# Altium schematic sheet Sheet1.SchDoc
size A2; SheetNumber: 2; SheetTotal: 4
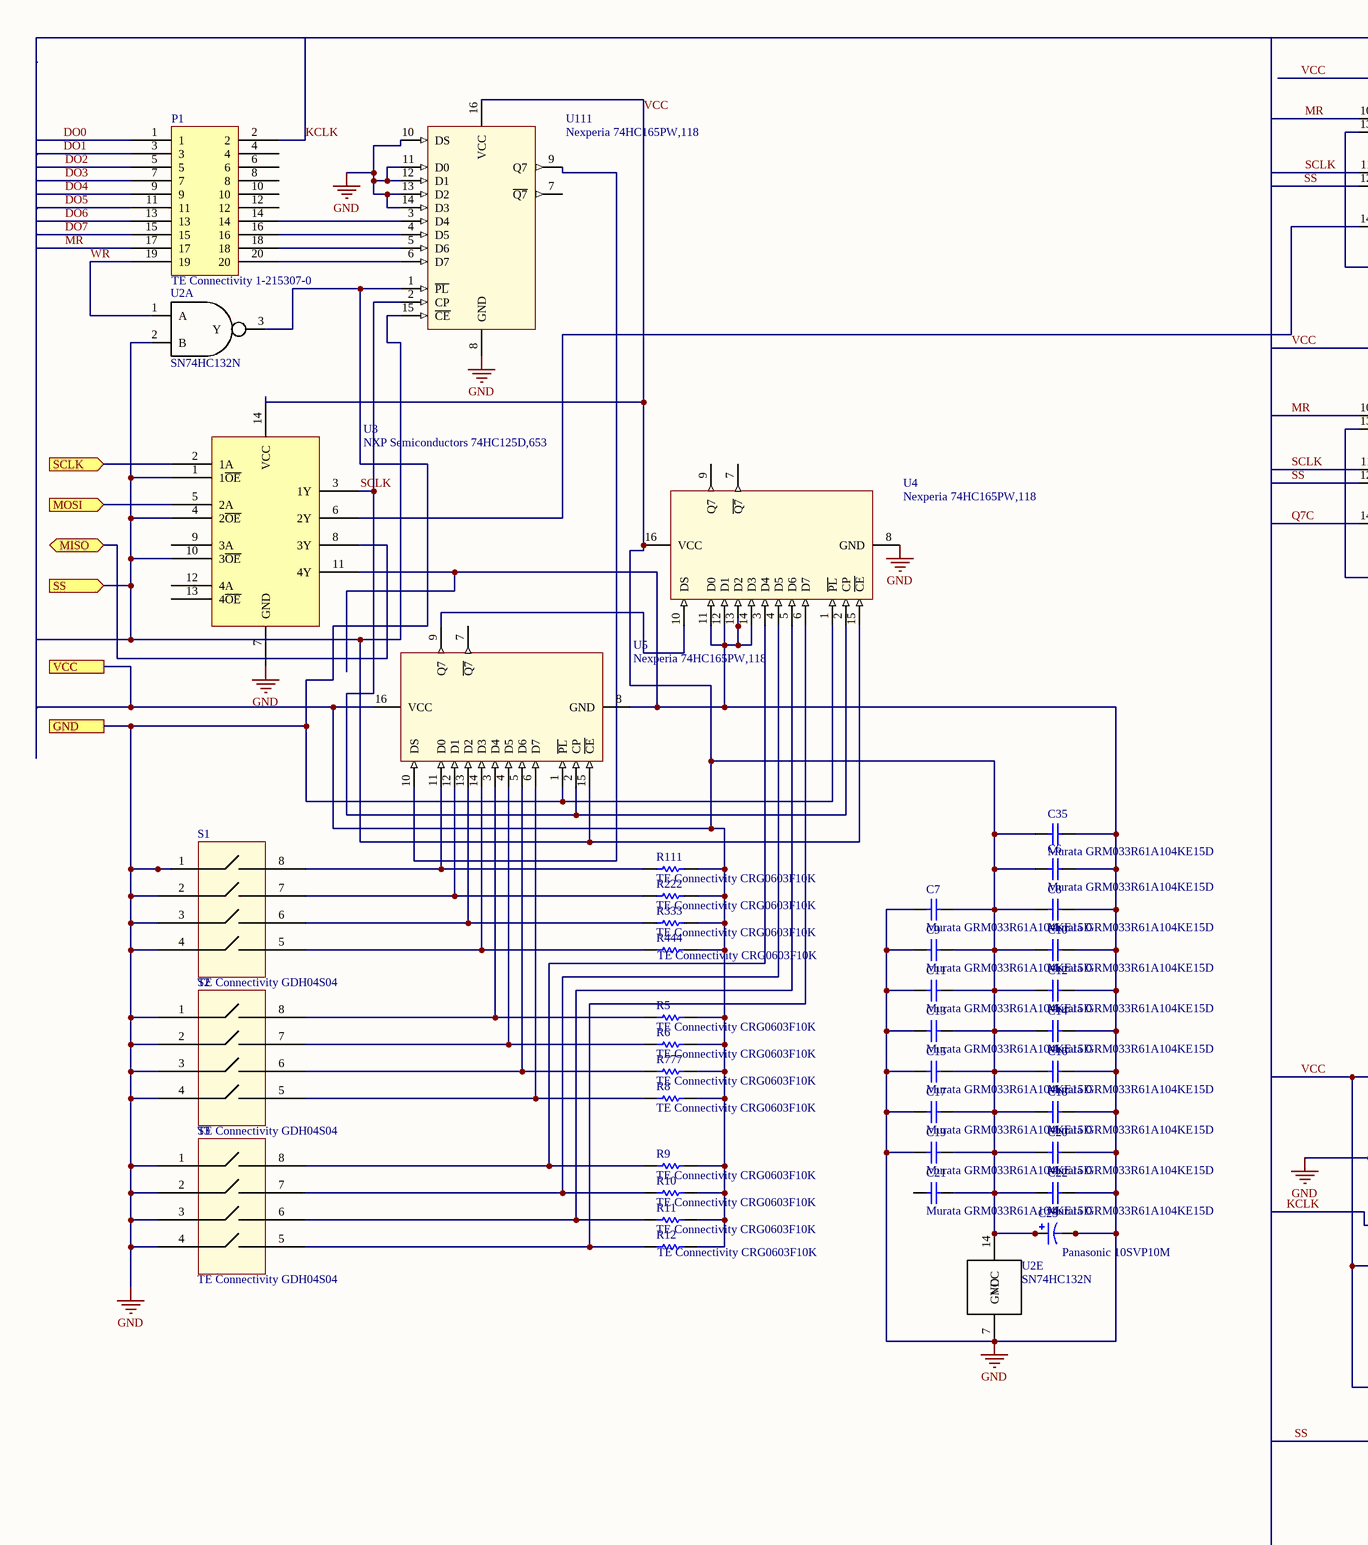
[diagram p0: Sheet1.SchDoc, left]
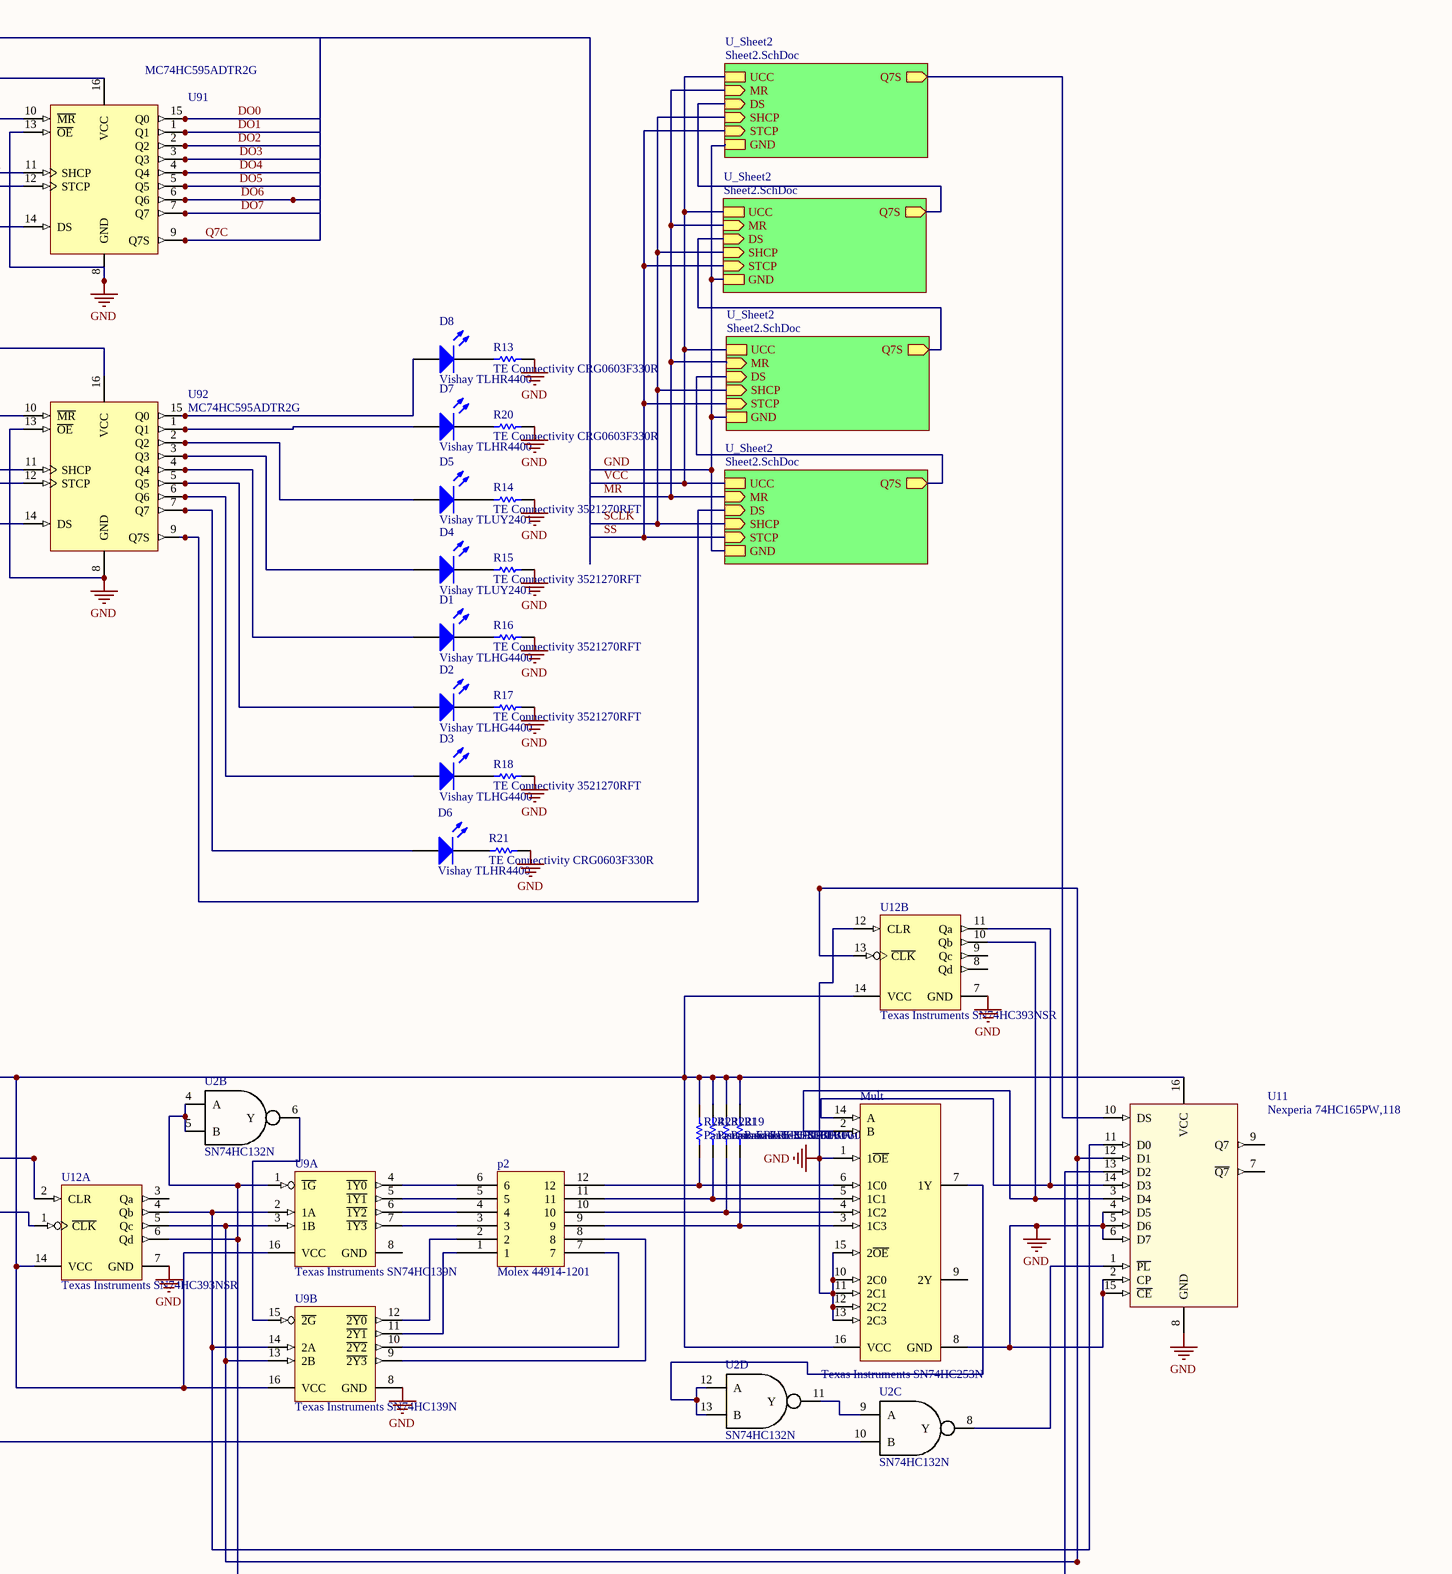
[diagram p1: Sheet1.SchDoc, right]

## Parts
C6  Murata GRM033R61A104KE15D  [201-cap]
C7  Murata GRM033R61A104KE15D  [201-cap]
C8  Murata GRM033R61A104KE15D  [201-cap]
C9  Murata GRM033R61A104KE15D  [201-cap]
C10  Murata GRM033R61A104KE15D  [201-cap]
C11  Murata GRM033R61A104KE15D  [201-cap]
C12  Murata GRM033R61A104KE15D  [201-cap]
C13  Murata GRM033R61A104KE15D  [201-cap]
C14  Murata GRM033R61A104KE15D  [201-cap]
C15  Murata GRM033R61A104KE15D  [201-cap]
C16  Murata GRM033R61A104KE15D  [201-cap]
C17  Murata GRM033R61A104KE15D  [201-cap]
C18  Murata GRM033R61A104KE15D  [201-cap]
C19  Murata GRM033R61A104KE15D  [201-cap]
C20  Murata GRM033R61A104KE15D  [201-cap]
C21  Murata GRM033R61A104KE15D  [201-cap]
C22  Murata GRM033R61A104KE15D  [201-cap]
C23  Panasonic 10SVP10M  [PCB-11675369-2]
C35  Murata GRM033R61A104KE15D  [201-cap]
D1  Vishay TLHG4400  [PCB-13611427-1]
D2  Vishay TLHG4400  [PCB-13611427-1]
D3  Vishay TLHG4400  [PCB-13611427-1]
D4  Vishay TLUY2401  [PCB-l34c6o5fqdn1w8o8huke-1]
D5  Vishay TLUY2401  [PCB-l34c6o5fqdn1w8o8huke-1]
D6  Vishay TLHR4400  [PCB-13611427-1]
D7  Vishay TLHR4400  [PCB-13611427-1]
D8  Vishay TLHR4400  [PCB-13611427-1]
Mult  Texas Instruments SN74HC253N  [PCB-ye28ecx4y6fys8yx3b68-1]
P1  TE Connectivity 1-215307-0  [TE Connectivity 1-215307-0-Footprint-1]
p2  Molex 44914-1201  [PCB-wm5mi6ljvffjb7arr4wv-1]
R5  TE Connectivity CRG0603F10K  [RESC1608X55X30NL15T15]
R6  TE Connectivity CRG0603F10K  [RESC1608X55X30NL15T15]
R8  TE Connectivity CRG0603F10K  [RESC1608X55X30NL15T15]
R9  TE Connectivity CRG0603F10K  [RESC1608X55X30NL15T15]
R10  TE Connectivity CRG0603F10K  [RESC1608X55X30NL15T15]
R11  TE Connectivity CRG0603F10K  [RESC1608X55X30NL15T15]
R12  TE Connectivity CRG0603F10K  [RESC1608X55X30NL15T15]
R13  TE Connectivity CRG0603F330R  [RESC1608X55X30NL15T15]
R14  TE Connectivity 3521270RFT  [PCB-8lzq24m2ds8udzy06dcv-1]
R15  TE Connectivity 3521270RFT  [PCB-8lzq24m2ds8udzy06dcv-1]
R16  TE Connectivity 3521270RFT  [PCB-8lzq24m2ds8udzy06dcv-1]
R17  TE Connectivity 3521270RFT  [PCB-8lzq24m2ds8udzy06dcv-1]
R18  TE Connectivity 3521270RFT  [PCB-8lzq24m2ds8udzy06dcv-1]
R19  Panasonic ERJ-3EKF3001V  [RESC1608X55X30LL15T15]
R20  TE Connectivity CRG0603F330R  [RESC1608X55X30NL15T15]
R21  TE Connectivity CRG0603F330R  [RESC1608X55X30NL15T15]
R111  TE Connectivity CRG0603F10K  [RESC1608X55X30NL15T15]
R221  Panasonic ERJ-3EKF3001V  [RESC1608X55X30LL15T15]
R222  TE Connectivity CRG0603F10K  [RESC1608X55X30NL15T15]
R231  Panasonic ERJ-3EKF3001V  [RESC1608X55X30LL15T15]
R241  Panasonic ERJ-3EKF3001V  [RESC1608X55X30LL15T15]
R333  TE Connectivity CRG0603F10K  [RESC1608X55X30NL15T15]
R444  TE Connectivity CRG0603F10K  [RESC1608X55X30NL15T15]
R777  TE Connectivity CRG0603F10K  [RESC1608X55X30NL15T15]
S1  TE Connectivity GDH04S04  [PCB-m0pir8bbp0qlyzv1so26-1]
S2  TE Connectivity GDH04S04  [PCB-m0pir8bbp0qlyzv1so26-1]
S3  TE Connectivity GDH04S04  [PCB-m0pir8bbp0qlyzv1so26-1]
U2  SN74HC132N  [DIP14]  (parts A,B,C,D,E of 5)
U3  NXP Semiconductors 74HC125D,653  [SO14]
U4  Nexperia 74HC165PW,118  [PCB-l7v5lpviuh96d6vuhrfj-1]
U5  Nexperia 74HC165PW,118  [PCB-l7v5lpviuh96d6vuhrfj-1]
U9  Texas Instruments SN74HC139N  [PCB-ctj26q9zb3sevqagct1v-1]  (parts A,B of 2)
U11  Nexperia 74HC165PW,118  [PCB-l7v5lpviuh96d6vuhrfj-1]
U12  Texas Instruments SN74HC393NSR  [SOIC-SL14_N]  (parts A,B of 2)
U91  MC74HC595ADTR2G  [MC74HC595ADTR2G-Footprint-1]
U92  MC74HC595ADTR2G  [MC74HC595ADTR2G-Footprint-1]
U111  Nexperia 74HC165PW,118  [PCB-l7v5lpviuh96d6vuhrfj-1]

## Sub-sheets
U_Sheet2 = Sheet2.SchDoc: UCC, MR (in), DS (in), SHCP (in), STCP (in), GND, Q7S (out)
U_Sheet2 = Sheet2.SchDoc: UCC, MR (in), DS (in), SHCP (in), STCP (in), GND, Q7S (out)
U_Sheet2 = Sheet2.SchDoc: UCC, MR (in), DS (in), SHCP (in), STCP (in), GND, Q7S (out)
U_Sheet2 = Sheet2.SchDoc: UCC, MR (in), DS (in), SHCP (in), STCP (in), GND, Q7S (out)

## Ports
GND, MISO (bidir), MOSI (in), SCLK (in), SS (in), VCC

## Nets
GND: C6.2 C7.1 C8.2 C9.1 C10.2 C11.1 C12.2 C13.1 C14.2 C15.1 C16.2 C17.1 C18.2 C19.1 C20.2 C22.2 C23.2 C35.2 Mult.1(1~{OE}) Mult.8(GND) Mult.10(2C0) Mult.11(2C1) Mult.12(2C2) Mult.13(2C3) Mult.15(2~{OE}) R13.2 R14.2 R15.2 R16.2 R17.2 R18.2 R20.2 R21.2 S1.1 S1.2 S1.3 S1.4 S2.1 S2.2 S2.3 S2.4 S3.1 S3.2 S3.3 S3.4 U2.3(Y) U2.7(GND) U3.7(GND) U3.11(4Y) U4.1(~{PL}) U4.8(GND) U4.11(D0) U4.12(D1) U4.13(D2) U4.14(D3) U5.1(~{PL}) U5.8(GND) U9.8(GND) U11.2(CP) U11.4(D5) U11.5(D6) U11.6(D7) U11.8(GND) U11.15(~{CE}) U12.2(CLR) U12.7(GND) U12.12(CLR) U91.8(GND) U91.13(~{OE}) U92.8(GND) U92.13(~{OE}) U111.1(~{PL}) U111.8(GND) U111.10(DS) U111.11(D0) U111.12(D1) U111.13(D2) U111.14(D3) ; port GND, sheet U_Sheet2/GND, sheet U_Sheet2/GND, sheet U_Sheet2/GND, sheet U_Sheet2/GND
DO0: P1.1 U91.15(Q0)
DO1: P1.3 U91.1(Q1)
DO2: P1.5 U91.2(Q2)
DO3: P1.7 U91.3(Q3)
DO4: P1.9 U91.4(Q4)
DO5: P1.11 U91.5(Q5)
DO6: P1.13 U91.6(Q6)
DO7: P1.15 U91.7(Q7)
KCLK: P1.2 U12.1(~{CLK})
MISO: U3.8(3Y) ; port MISO
MOSI: U3.5(2A) ; port MOSI
MR: P1.17 U91.10(~{MR}) U92.10(~{MR}) ; sheet U_Sheet2/MR, sheet U_Sheet2/MR, sheet U_Sheet2/MR, sheet U_Sheet2/MR
Q7C: U91.9(Q7S) U92.14(DS)
SCLK: U3.3(1Y) U4.2(CP) U5.2(CP) U91.11(SHCP) U92.11(SHCP) U111.2(CP) ; sheet U_Sheet2/SHCP, sheet U_Sheet2/SHCP, sheet U_Sheet2/SHCP, sheet U_Sheet2/SHCP
SCLK: U3.2(1A) ; port SCLK  [a separate net that carries the same name]
SS: U2.2(B) U3.1(1~{OE}) U3.4(2~{OE}) U3.10(3~{OE}) U4.15(~{CE}) U5.15(~{CE}) U111.15(~{CE}) ; port SS
SS: U2.10(B) U91.12(STCP) U92.12(STCP) ; sheet U_Sheet2/STCP, sheet U_Sheet2/STCP, sheet U_Sheet2/STCP, sheet U_Sheet2/STCP  [a separate net that carries the same name]
VCC: C6.1 C7.2 C8.1 C9.2 C10.1 C11.2 C12.1 C13.2 C14.1 C15.2 C16.1 C17.2 C18.1 C19.2 C20.1 C21.2 C22.1 C23.1 C35.1 Mult.16(VCC) R5.1 R6.1 R8.1 R9.1 R10.1 R11.1 R12.1 R19.1 R111.1 R221.1 R222.1 R231.1 R241.1 R333.1 R444.1 R777.1 U2.14(VCC) U3.14(VCC) U4.16(VCC) U5.16(VCC) U9.16(VCC) U11.16(VCC) U12.14(VCC) U91.16(VCC) U92.16(VCC) U111.16(VCC) ; port VCC, sheet U_Sheet2/UCC, sheet U_Sheet2/UCC, sheet U_Sheet2/UCC, sheet U_Sheet2/UCC
WR: P1.19 U2.1(A)
NetD1_1: D1.1(A) U92.4(Q4)
NetD1_2: D1.2(K) R16.1
NetD2_1: D2.1(A) U92.5(Q5)
NetD2_2: D2.2(K) R17.1
NetD3_1: D3.1(A) U92.6(Q6)
NetD3_2: D3.2(K) R18.1
NetD4_1: D4.1(A) U92.3(Q3)
NetD4_2: D4.2(K) R15.1
NetD5_1: D5.1(A) U92.2(Q2)
NetD5_2: D5.2(K) R14.1
NetD6_1: D6.1(A) U92.7(Q7)
NetD7_1: D7.1(A) U92.1(Q1)
NetD7_2: D7.2(K) R20.1
NetD8_1: D8.1(A) U92.15(Q0)
NetD8_2: D8.2(K) R13.1
NetMult_2: Mult.2(B) U11.3(D4) U12.10(Qb)
NetMult_3: Mult.3(1C3) p2.9 R19.2
NetMult_4: Mult.4(1C2) p2.10 R221.2
NetMult_5: Mult.5(1C1) p2.11 R231.2
NetMult_6: Mult.6(1C0) p2.12 R241.2
NetMult_7: Mult.7(1Y) U2.12(A) U2.13(B)
NetMult_14: Mult.14(A) U11.14(D3) U12.11(Qa)
NetP1_14: P1.14 U111.3(D4)
NetP1_16: P1.16 U111.4(D5)
NetP1_18: P1.18 U111.5(D6)
NetP1_20: P1.20 U111.6(D7)
Netp2_1: p2.1 U9.11(~{2Y1})
Netp2_2: p2.2 U9.12(~{2Y0})
Netp2_3: p2.3 U9.7(~{1Y3})
Netp2_4: p2.4 U9.6(~{1Y2})
Netp2_5: p2.5 U9.5(~{1Y1})
Netp2_6: p2.6 U9.4(~{1Y0})
Netp2_7: p2.7 U9.10(~{2Y2})
Netp2_8: p2.8 U9.9(~{2Y3})
NetR5_2: R5.2 S2.8 U5.3(D4)
NetR6_2: R6.2 S2.7 U5.4(D5)
NetR8_2: R8.2 S2.5 U5.6(D7)
NetR9_2: R9.2 S3.8 U4.3(D4)
NetR10_2: R10.2 S3.7 U4.4(D5)
NetR11_2: R11.2 S3.6 U4.5(D6)
NetR12_2: R12.2 S3.5 U4.6(D7)
NetR111_2: R111.2 S1.8 U5.11(D0)
NetR222_2: R222.2 S1.7 U5.12(D1)
NetR333_2: R333.2 S1.6 U5.13(D2)
NetR444_2: R444.2 S1.5 U5.14(D3)
NetR777_2: R777.2 S2.6 U5.5(D6)
NetU2_4: U2.4(A) U2.5(B) U9.1(~{1G}) U11.13(D2) U12.6(Qd)
NetU2_6: U2.6(Y) U9.15(~{2G})
NetU2_8: U2.8(Y) U11.1(~{PL})
NetU2_9: U2.9(A) U2.11(Y)
NetU3_6: U3.6(2Y) U91.14(DS)
NetU4_10: U4.10(DS) U5.9(Q7)
NetU5_10: U5.10(DS) U111.9(Q7)
NetU9_2: U9.2(1A) U9.14(2A) U11.11(D0) U12.4(Qb)
NetU9_3: U9.3(1B) U9.13(2B) U11.12(D1) U12.5(Qc) U12.13(~{CLK})
NetU11_10: U11.10(DS) ; sheet U_Sheet2/Q7S
NetU92_9: U92.9(Q7S) ; sheet U_Sheet2/DS
(unnamed): sheet U_Sheet2/Q7S, sheet U_Sheet2/DS
(unnamed): sheet U_Sheet2/Q7S, sheet U_Sheet2/DS
(unnamed): sheet U_Sheet2/Q7S, sheet U_Sheet2/DS

Not connected (* = marked no-connect by the designer): C21 1; D6 2(K); Mult 9(2Y); P1 4 6 8 10 12; R21 1; U3 9(3A) 12(4A) 13(4~{OE}); U4 7(~{Q7}) 9(Q7); U5 7(~{Q7}); U11 7(~{Q7}) 9(Q7); U12 3(Qa) 8(Qd) 9(Qc); U111 7(~{Q7})

## Library data of the parts
C6-C22 C35 = CMP-118834-6: Cap Ceramic 0.1uF 10V X5R 10% SMD 0201 85C Paper T/R; Lead-Free Status: Lead Free; Case/Package (SI): 0603; Capacitance: 100 nF; REACH SVHC Compliance: No SVHC; Capacitance Tolerance: ±10%; Voltage Rating (DC): 10 V; Lifecycle Status: Active; Octopart Url: https://octopart.com/grm033r61a104ke15d-murata-9105476; Footprint: PCB-ocfpa7uzfom1ouwa1npm-1; Size-Length: 0.0006 m; Size-Thickness: 0.0003 m; Manufacturer Part Number: GRM033R61A104KE15D; Dielectric Characteristic: X5R; OctopartID: 128bdb0bc7a9cd4c; RoHS: Compliant; Size-Width: 0.0003 m
C23 = CMP-11675369-3: CAP ALUM 10UF 10V 20% SMD; Capacitance: 1e-05 F; Equivalent Series Resistance (ESR): 0.22 Ω; Lead-Free Status: Lead Free; Voltage Rating (DC): 10.0 V; Capacitance Tolerance: ±20%; Lifecycle Status: Not Listed by Manufacturer; Octopart Url: https://octopart.com/10svp10m-panasonic-29498231; OctopartID: 0b69c3a13578d4ae; Packaging: Cut Tape (CT); REACH SVHC Compliance: No SVHC; RoHS: Compliant; Size-Diameter: 0.004 m; Size-Height: 0.0054 m; Manufacturer Part Number: 10SVP10M
D1-D3 = CMP-96ad5dfef654496a-28: LED; Green; 2.5mcd; 3mmDia.; T-1; 20mA; 2.4V; 569nm; +/-30deg; GaP on GaP; 15V; 100mW
D4 D5 = CMP-e0242b7785343fe3-2: LED; Yellow; 8mcd; 2.4mm; T-3/4; 30mA; 2.4V; +/-20deg; 585nm; GaAsP on GaP; Lens Type: Diffused; Luminous Intensity: 8.00 mcd; Wavelength: 594 nm; Voltage Rating (DC): 2.40 V; Lead Length: 25.4 mm; Power Dissipation: 100 mW; Lead-Free Status: Lead Free; Viewing Angle: 20 °; Operating Temperature: -40.0 °C (min); RoHS: Compliant; Manufacturer Part Number: TLUY2401; OctopartID: e0242b7785343fe3; Mounting Style: Through Hole, PCB; Number of Pins: 2; Peak Wavelength: 585 nm; Size-Diameter: 2.40 mm; Forward Voltage: 2.40 V; Octopart URL: https://octopart.com/tluy2401-vishay-39403638; Color: Yellow
D6-D8 = CMP-87d34d9479b75814-3: LED; Red; 3mcd; 3mmDia.; T-1; 30mA; 2V; 635nm; +/-30deg; GaAsP on GaP; 15V; 100mW; Forward Voltage: 2.00 V; Viewing Angle: 30 °; Lead-Free Status: Lead Free; Luminous Intensity: 3.00 mcd; Wavelength: 625 nm; Packaging: Bulk; Number of Pins: 2; Octopart Url: https://octopart.com/tlhr4400-vishay-55433986; Mounting Style: Through Hole, PCB; Color: Red; Size-Diameter: 3.00 mm; Manufacturer Part Number: TLHR4400; Power Dissipation: 100 mW; Peak Wavelength: 635 nm; Operating Temperature: -40.0 °C (min); RoHS: Compliant; OctopartID: 87d34d9479b75814
Mult = CMP-94ae5da5050f4b69-1: Dual 4-Line To 1-Line Data Selectors/Multiplexers With 3-State Outputs 16-PDIP -40 to 85; Bandwidth: 28.0 MHz; Supply Voltage (DC): 2.00 V to 6.00 V; Polarity: Non-Inverting; Voltage Nodes: 2.00 V, 5.00 V, 6.00 V; Output Current Drive: -1.00 mA; Quiescent Current: 8.00 µA (max); Contacts Type: 4PST; Number of Bits: 4; Number of Circuits: 2; Lead-Free Status: Lead Free; Operating Temperature: -40.0 °C to 85.0 °C; Packaging: Tube; Case/Package: PDIP, SOIC; Octopart URL: https://octopart.com/sn74hc253n-texas+instruments-111815; REACH SVHC Compliance: No SVHC; Number of Pins: 16; OctopartID: 94ae5da5050f4b69; Manufacturer Part Number: SN74HC253N; RoHS: Compliant; Mounting Style: Through Hole; Lifecycle Status: Active
P1 = CMP-5b4e90303ce88489-3: AMPMODU Series 10 Position Dual Row 2.54 mm Through Hole Receptacle; Number of Contacts: 20; Number of Positions: 10; Gender: Female; ELV Compliant: Compliant; Housing Color: Green; Flammability Rating: UL 94 V-0; Packaging: Bulk; REACH SVHC Compliance: No SVHC; Color: Green; Operating Temperature: -55.0 °C to 105 °C; Housing Material: Polyester; Octopart Url: https://octopart.com/1-215307-0-te+connectivity-41173696; RoHS: Compliant; Mounting Style: Through Hole, Vertical, PCB; OctopartID: 5b4e90303ce88489; Lifecycle Status: Active; Contact Plating: Tin, Gold; Orientation: Vertical; Contact Material: Phosphor Bronze; Manufacturer Part Number: 1-215307-0
p2 = CMP-e0aa29c762ee3f6d-3: Conn Power HDR 12 POS 3mm Press Fit ST Thru-Hole 12 Terminal 1 Port Micro-Fit 3.0 CPI™ Tray
R5 R6 R8-R12 R111 R222 R333 R444 R777 = CMP-584891b72cc4878f-5: Thick Film Resistors - SMD 10K Ohm 1% 1/10W Res Thick Film 0603; Resistance: 10.0 kΩ; ELV Compliant: Compliant; Power Rating: 100 mW; Lead-Free Status: Lead Free; Lifecycle Status: Active; Octopart URL: https://octopart.com/crg0603f10k-te+connectivity-16077290; Manufacturer: TE Connectivity; Series: CRG; Manufacturer Part Number: CRG0603F10K; Footprint: PCB-ardgfr1918pjvxvewvwp-1; OctopartID: 584891b72cc4878f; Case/Package: 0603; Mounting Style: Surface Mount; RoHS: Compliant; Packaging: Tape & Reel (TR)
R13 R20 R21 = CMP-139fda6064c8cc58-2: Res Thick Film 0603 330 Ohm 1% 0.1W(1/10W) ±100ppm/C Pad SMD T/R; ELV Compliant: Compliant; Resistance: 330 Ω; Power Rating: 100 mW; Manufacturer Part Number: CRG0603F330R; Footprint: PCB-0002-00066-3; RoHS: Compliant; Mounting Style: Surface Mount; Lifecycle Status: Active; Case/Package: 0603; OctopartID: 139fda6064c8cc58; Packaging: Tape & Reel (TR); Octopart URL: https://octopart.com/crg0603f330r-te+connectivity-16077361
R14-R18 = CMP-1f58d739f3e6c09f-1: 3521 Series 2512 270 Ohm ±1 % 2 W ±100 ppm/°C Surface Mount Thick Film Resistor; Resistance Tolerance: ±1%; Voltage Rating (DC): 250 V; Resistance: 270 Ω; ELV Compliant: Compliant; Lead-Free Status: Lead Free; Temperature Coefficient: -100 ppm/°C to 100 ppm/°C; Power Rating: 2.00 W; REACH SVHC Compliance: No SVHC; RoHS: Compliant; Manufacturer Part Number: 3521270RFT; Lifecycle Status: Not Listed by Manufacturer; Octopart Url: https://octopart.com/3521270rft-te+connectivity-23841240; OctopartID: 1f58d739f3e6c09f; Mounting Style: Surface Mount; Packaging: Tape & Reel (TR)
R19 R221 R231 R241 = CMP-3655905-2: Thick Film Resistors - SMD 0603 3Kohms 1% Tol; Lead-Free Status: Lead Free; Power Rating: 0.1 W; Resistance: 3000.0 Ω; Voltage Rating (DC): 75.0 V; Case/Package: 0603; Lifecycle Status: Not Listed by Manufacturer; Mounting Style: Surface Mount; Octopart Url: https://octopart.com/erj-3ekf3001v-panasonic-42329147; OctopartID: 963d5db2576049fa; REACH SVHC Compliance: No SVHC; Resistance Tolerance: ±1%; RoHS: Compliant; Manufacturer Part Number: ERJ-3EKF3001V
S1-S3 = CMP-6f23a477cc17b0e4-5: Switch DIP OFF ON SPST 4 Recessed Rocker 0.025A 24VDC Gull Wing 1.27mm SMD; Lead-Free Status: Lead Free; Contact Resistance: 100 mΩ; Number of Positions: 4; Manufacturer Part Number: GDH04S04; Contact Plating: Gold; Pin Pitch: 1.27 mm; RoHS: Compliant; Contacts Type: SPST; Size-Length: 6.20 mm; Size-Width: 6.00 mm; Orientation: Vertical; Octopart URL: http://octopart.com/gdh04s04-te+connectivity-39749202; Size-Height: 2.30 mm; Mounting Style: Surface Mount; Lifecycle Status: Not Listed by Manufacturer; Actuator Type: Rocker; REACH SVHC Compliance: No SVHC; Flammability Rating: UL 94 V-0; Insulation Resistance: 100 MΩ; OctopartID: 6f23a477cc17b0e4; Footprint: PCB-hg5w1tp1hwp4ddcu42yg-1
U2 = CMP-ee722778a28031b5-2: Quadruple Positive-NAND Gates With Schmitt-Trigger Inputs 14-PDIP -40 to 85; Number of Circuits: 4; Supply Voltage (DC): 2.00 V to 6.00 V; Voltage Nodes: 6.00 V, 5.00 V, 2.00 V; Lead-Free Status: Lead Free; Propagation Delay Max (tpd): 27.0 ns; Output Current: 5.20 mA; Output Current Drive: -1.00 mA; Octopart URL: http://octopart.com/sn74hc132n-texas+instruments-27028; Number of Pins: 14; RoHS: Compliant; Number of Gates: 4; Manufacturer Part Number: SN74HC132N; OctopartID: ee722778a28031b5; Number of Bits: 4; Case/Package: PDIP; REACH SVHC Compliance: No SVHC; Packaging: Tube; Lifecycle Status: Active; Footprint: PCB-547ae6yrb5qq8sq3b9tw-1; Mounting Style: Through Hole
U3 = CMP-e63b2fae16a839fc-1: 74HC Series 6 V Surface Mount 3-State Quad Buffer/Line Driver - SOIC-14; Lead-Free Status: Lead Free; Number of Gates: 4; Supply Voltage (DC): 2.00 V (min); REACH SVHC Compliance: No SVHC; Lifecycle Status: Active; Packaging: Tape & Reel (TR); Manufacturer Part Number: 74HC125D,653; OctopartID: e63b2fae16a839fc; Octopart URL: http://octopart.com/74hc125d%2C653-nxp+semiconductors-10474997; Number of Pins: 14; RoHS: Compliant
U4 U5 U11 U111 = CMP-d6a61b1d9d060961-1: 74HC Series 6 V 8-Bit Parallel-In/Serial Out Shift Register - TSSOP-16; RoHS: Compliant; OctopartID: d6a61b1d9d060961; Manufacturer Part Number: 74HC165PW,118; Octopart Url: https://octopart.com/74hc165pw%2C118-nexperia-78737094; Lifecycle Status: Active; Number of Pins: 14
U9 = CMP-00b6c9bc66ecdf71-2: Dual 2-Line To 4-Line Decoders/Demultiplexers 16-PDIP -40 to 85; Lead-Free Status: Lead Free; Number of Outputs: 4; Number of Circuits: 2; Output Current Drive: -1.00 mA; Contacts Type: DP4T; Supply Voltage (DC): 2.00 V to 6.00 V; Voltage Nodes: 6.00 V, 5.00 V, 2.00 V; Packaging: Tube; Number of Pins: 16; Number of Bits: 4; Case/Package: SOIC, PDIP; Lifecycle Status: Active; Manufacturer Part Number: SN74HC139N; Octopart URL: http://octopart.com/sn74hc139n-texas+instruments-17212; Mounting Style: Through Hole; RoHS: Compliant; OctopartID: 00b6c9bc66ecdf71; REACH SVHC Compliance: No SVHC
U12 = CMP-3cf3f5f3f6c2e334-2: Counter/Divider Dual 4-Bit Binary UP 14-Pin SOP T/R   SMD; Voltage Nodes: 2.00 V, 5.00 V, 6.00 V; Number of Bits: 4; Output Current Drive: -1.00 mA; Clock Speed: 60.0 MHz; Supply Voltage (DC): 2.00 V to 6.00 V; Lead-Free Status: Lead Free; Packaging: Reel; Lifecycle Status: Active; Operating Temperature: -40.0 °C to 85.0 °C; Footprint: PCC-0016-00091-1; Number of Pins: 14; Manufacturer Part Number: SN74HC393NSR; OctopartID: 3cf3f5f3f6c2e334; Mounting Style: Surface Mount; RoHS: Compliant; Octopart URL: https://octopart.com/sn74hc393nsr-texas+instruments-716631; Case/Package: SOP
U91 U92 = CMP-ba6473693a2065a3-3: Shift Shift Register 1 Element 8 Bit 16-TSSOP; OctopartID: ba6473693a2065a3